# Altium schematic sheet EPS_Top.SchDoc: Top
size A3
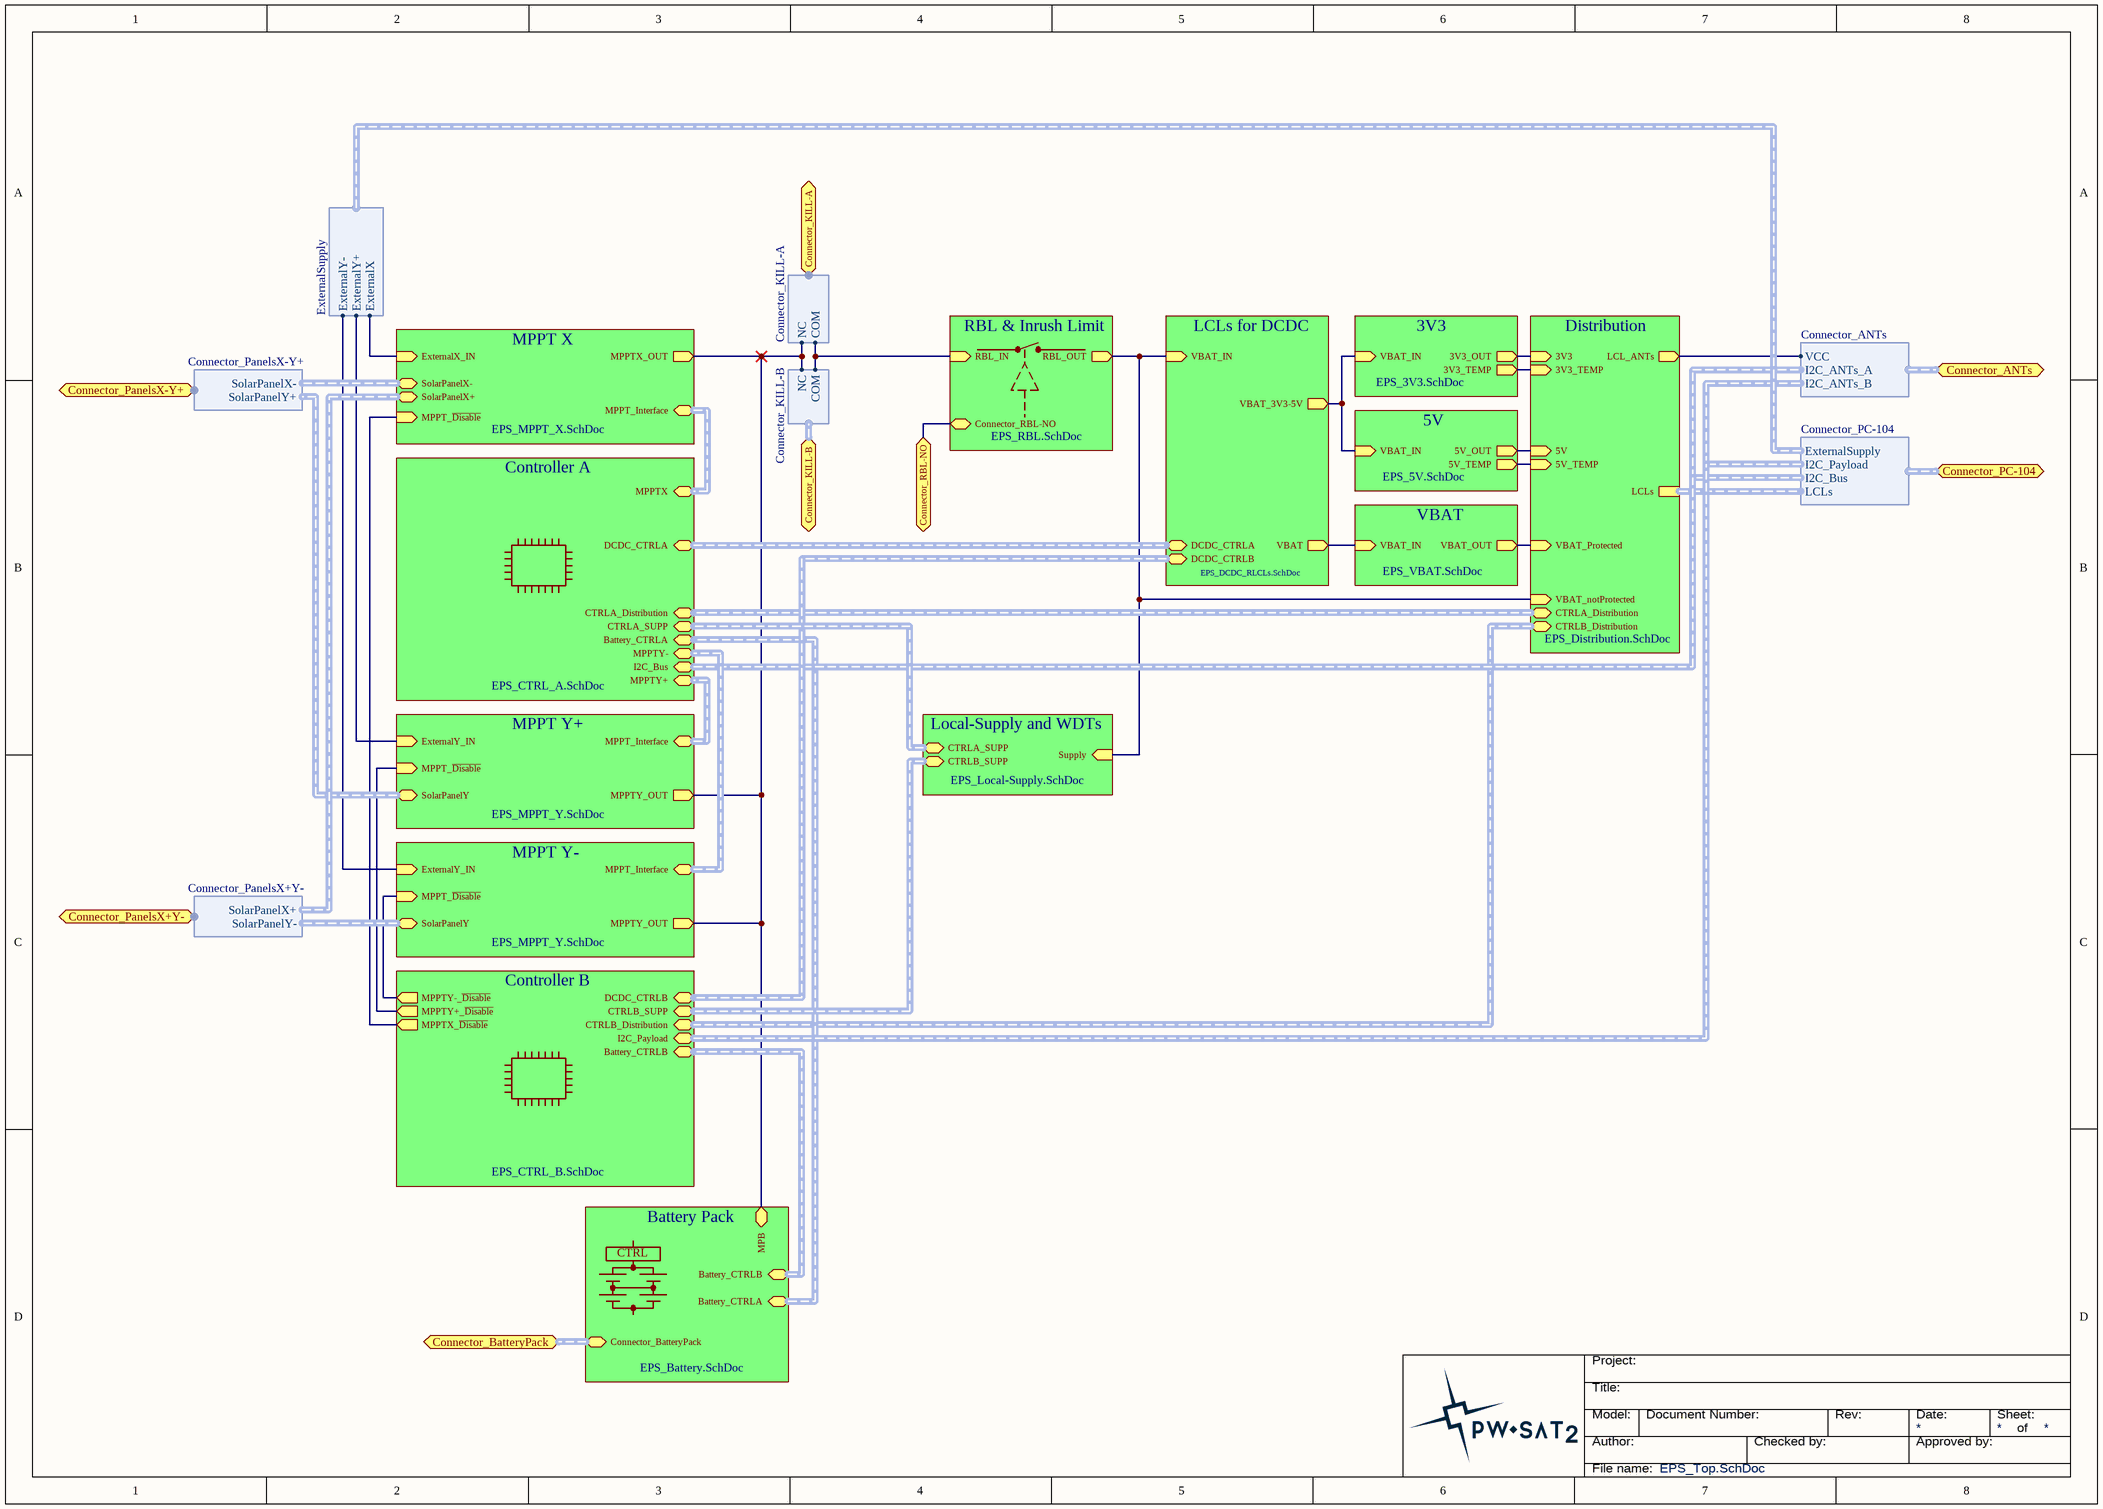
[diagram p0: EPS_Top.SchDoc]

## Sub-sheets
3V3 = EPS_3V3.SchDoc: 3V3_OUT (out), VBAT_IN (in), 3V3_TEMP (out)
5V = EPS_5V.SchDoc: 5V_OUT (out), VBAT_IN (in), 5V_TEMP (out)
Battery Pack = EPS_Battery.SchDoc: MPB (bidir), Connector_BatteryPack (harness Connector_BatteryPack), Battery_CTRLA (harness Battery_CTRLA), Battery_CTRLB (harness Battery_CTRLB)
Controller A = EPS_CTRL_A.SchDoc: CTRLA_Distribution (harness CTRLA_Distribution), Battery_CTRLA (harness Battery_CTRLA), I2C_Bus (harness I2C), MPPTX (harness MPPT_Interface), DCDC_CTRLA (harness DCDC_CTRLA), CTRLA_SUPP (harness CTRLA_SUPP), MPPTY+ (harness MPPT_Interface), MPPTY- (harness MPPT_Interface)
Controller B = EPS_CTRL_B.SchDoc: Battery_CTRLB (harness Battery_CTRLB), I2C_Payload (harness I2C), CTRLB_Distribution (harness CTRLB_Distribution), DCDC_CTRLB (harness DCDC_CTRLB), CTRLB_SUPP (harness CTRLB_SUPP), MPPTY-_~{Disable} (out), MPPTX_~{Disable} (out), MPPTY+_~{Disable} (out)
Distribution = EPS_Distribution.SchDoc: 3V3 (in), 5V (in), LCLs (harness LCLs), CTRLB_Distribution (harness CTRLB_Distribution), CTRLA_Distribution (harness CTRLA_Distribution), VBAT_notProtected (in), VBAT_Protected (in), LCL_ANTs (out), 3V3_TEMP (in), 5V_TEMP (in)
LCLs for DCDC = EPS_DCDC_RLCLs.SchDoc: VBAT_IN (in), VBAT_3V3-5V (out), VBAT (out), DCDC_CTRLB (harness DCDC_CTRLB), DCDC_CTRLA (harness DCDC_CTRLA)
Local-Supply and WDTs = EPS_Local-Supply.SchDoc: Supply (in), CTRLA_SUPP (harness CTRLA_SUPP), CTRLB_SUPP (harness CTRLB_SUPP)
MPPT X = EPS_MPPT_X.SchDoc: ExternalX_IN (in), SolarPanelX- (harness SolarPanelX-), SolarPanelX+ (harness SolarPanelX+), MPPTX_OUT (out), MPPT_Interface (harness MPPT_Interface), MPPT_~{Disable} (in)
MPPT Y+ = EPS_MPPT_Y.SchDoc: ExternalY_IN (in), SolarPanelY (harness SolarPanelY), MPPTY_OUT (out), MPPT_Interface (harness MPPT_Interface), MPPT_~{Disable} (in)
MPPT Y- = EPS_MPPT_Y.SchDoc: ExternalY_IN (in), SolarPanelY (harness SolarPanelY), MPPTY_OUT (out), MPPT_Interface (harness MPPT_Interface), MPPT_~{Disable} (in)
RBL & Inrush Limit = EPS_RBL.SchDoc: RBL_OUT (out), RBL_IN (in), Connector_RBL-NO (bidir)
VBAT = EPS_VBAT.SchDoc: VBAT_OUT (out), VBAT_IN (in)

## Ports
Connector_ANTs (harness Connector_ANTs), Connector_BatteryPack (harness Connector_BatteryPack), Connector_KILL-A (harness Connector_KILL-A), Connector_KILL-B (harness Connector_KILL-B), Connector_PanelsX+Y- (harness Connector_PanelsX+Y-), Connector_PanelsX-Y+ (harness Connector_PanelsX-Y+), Connector_PC-104 (harness Connector_PC-104), Connector_RBL-NO (bidir)

## Harnesses
Connector_KILL-A: COM, NC
Connector_KILL-B: COM, NC
Connector_PC-104: I2C_Payload, LCLs, I2C_Bus, ExternalSupply
Connector_PanelsX-Y+: SolarPanelX-, SolarPanelY+
Connector_PanelsX+Y-: SolarPanelX+, SolarPanelY-
Connector_ANTs: I2C_ANTs_A, VCC, I2C_ANTs_B
ExternalSupply: ExternalX, ExternalY-, ExternalY+

## Nets
Connector_RBL-NO: port Connector_RBL-NO, sheet RBL & Inrush Limit/Connector_RBL-NO
(unnamed): sheet MPPT X/ExternalX_IN, harness ExternalSupply.ExternalX
(unnamed): sheet MPPT X/MPPTX_OUT, sheet MPPT Y+/MPPTY_OUT, sheet Battery Pack/MPB, sheet MPPT Y-/MPPTY_OUT, port Connector_KILL-A.NC, port Connector_KILL-B.NC
(unnamed): sheet MPPT X/MPPT_~{Disable}, sheet Controller B/MPPTX_~{Disable}
(unnamed): sheet MPPT Y+/ExternalY_IN, harness ExternalSupply.ExternalY+
(unnamed): sheet MPPT Y+/MPPT_~{Disable}, sheet Controller B/MPPTY+_~{Disable}
(unnamed): sheet 3V3/3V3_OUT, sheet Distribution/3V3
(unnamed): sheet 3V3/VBAT_IN, sheet 5V/VBAT_IN, sheet LCLs for DCDC/VBAT_3V3-5V
(unnamed): sheet 3V3/3V3_TEMP, sheet Distribution/3V3_TEMP
(unnamed): sheet 5V/5V_OUT, sheet Distribution/5V
(unnamed): sheet 5V/5V_TEMP, sheet Distribution/5V_TEMP
(unnamed): sheet RBL & Inrush Limit/RBL_OUT, sheet Distribution/VBAT_notProtected, sheet LCLs for DCDC/VBAT_IN, sheet Local-Supply and WDTs/Supply
(unnamed): sheet RBL & Inrush Limit/RBL_IN, port Connector_KILL-A.COM, port Connector_KILL-B.COM
(unnamed): sheet Distribution/VBAT_Protected, sheet VBAT/VBAT_OUT
(unnamed): sheet Distribution/LCL_ANTs, port Connector_ANTs.VCC
(unnamed): sheet VBAT/VBAT_IN, sheet LCLs for DCDC/VBAT
(unnamed): sheet MPPT Y-/ExternalY_IN, harness ExternalSupply.ExternalY-
(unnamed): sheet MPPT Y-/MPPT_~{Disable}, sheet Controller B/MPPTY-_~{Disable}

## Buses and harness runs
harness port Connector_BatteryPack = sheet Battery Pack/Connector_BatteryPack
harness sheet Battery Pack/Battery_CTRLA = sheet Controller A/Battery_CTRLA
harness sheet Battery Pack/Battery_CTRLB = sheet Controller B/Battery_CTRLB
harness sheet Controller A/CTRLA_Distribution = sheet Distribution/CTRLA_Distribution
harness sheet Controller A/CTRLA_SUPP = sheet Local-Supply and WDTs/CTRLA_SUPP
harness sheet Controller A/DCDC_CTRLA = sheet LCLs for DCDC/DCDC_CTRLA
harness sheet Controller A/MPPTX = sheet MPPT X/MPPT_Interface
harness sheet Controller A/MPPTY+ = sheet MPPT Y+/MPPT_Interface
harness sheet Controller A/MPPTY- = sheet MPPT Y-/MPPT_Interface
harness sheet Controller B/CTRLB_Distribution = sheet Distribution/CTRLB_Distribution
harness sheet Controller B/CTRLB_SUPP = sheet Local-Supply and WDTs/CTRLB_SUPP
harness sheet Controller B/DCDC_CTRLB = sheet LCLs for DCDC/DCDC_CTRLB

## Notes on the sheet
- CTRL
- Title:
- Project:
- Author:
- Model:
- Document Number:
- Checked by:
- Rev:
- Date:
- Approved by:
- Sheet:
- of
- File name: